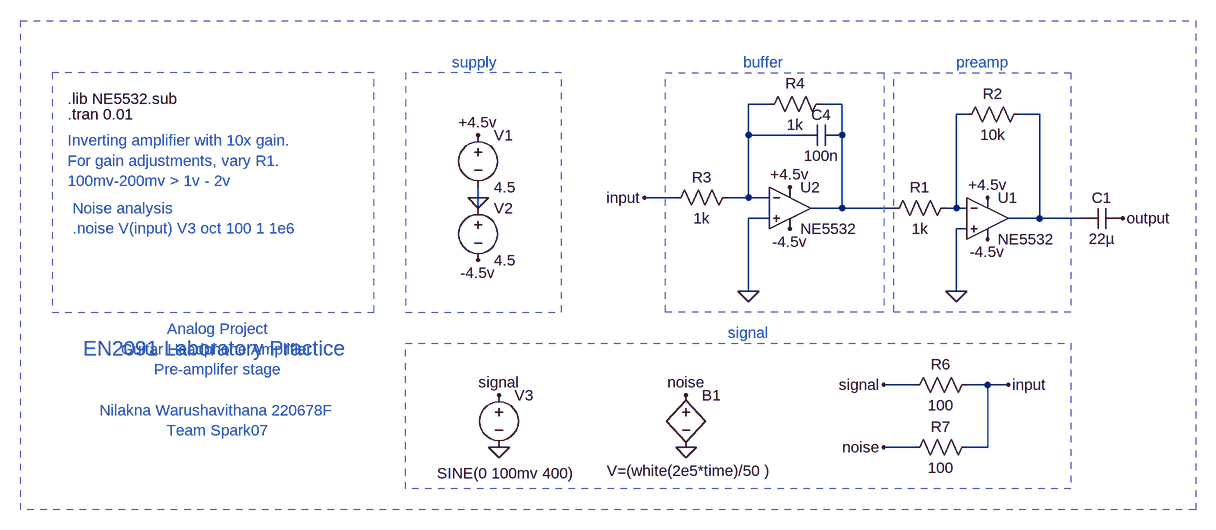
[diagram p0: schematic preamp_9vdual_opamp_NE5532.asc]
preamp_9vdual_opamp_NE5532.asc, the LTspice schematic file:
Version 4
SHEET 1 1812 680
WIRE 272 16 240 16
WIRE 384 16 352 16
WIRE 576 32 560 32
WIRE 688 32 656 32
WIRE 240 64 240 16
WIRE 320 64 240 64
WIRE 384 64 384 16
WIRE -176 160 -176 144
WIRE 128 160 80 160
WIRE 240 160 240 64
WIRE 240 160 208 160
WIRE 272 160 240 160
WIRE -176 176 -176 160
WIRE 384 176 384 64
WIRE 384 176 336 176
WIRE 464 176 384 176
WIRE 560 176 560 32
WIRE 560 176 544 176
WIRE 576 176 560 176
WIRE 272 192 240 192
WIRE 688 192 688 32
WIRE 688 192 640 192
WIRE 752 192 688 192
WIRE 576 208 560 208
WIRE 240 304 240 192
WIRE 560 304 560 208
WIRE 496 448 448 448
WIRE 608 448 576 448
WIRE 640 448 608 448
WIRE 496 544 448 544
WIRE 608 544 608 448
WIRE 608 544 576 544
FLAG -176 160 0
FLAG -176 64 +4.5v
FLAG 608 160 +4.5v
FLAG 608 224 -4.5v
FLAG -176 256 -4.5v
FLAG -144 544 0
FLAG -144 464 signal
FLAG 80 160 input
FLAG 560 304 0
FLAG 240 304 0
FLAG 304 144 +4.5v
FLAG 304 208 -4.5v
FLAG 816 192 output
FLAG 144 544 0
FLAG 144 464 noise
FLAG 448 448 signal
FLAG 448 544 noise
FLAG 640 448 input
SYMBOL OpAmps\\opamp2 608 128 R0
SYMATTR InstName U1
SYMATTR Value NE5532
SYMBOL voltage -176 48 R0
WINDOW 123 0 0 Left 0
WINDOW 39 0 0 Left 0
SYMATTR InstName V1
SYMATTR Value 4.5
SYMBOL voltage -176 160 R0
WINDOW 123 0 0 Left 0
WINDOW 39 0 0 Left 0
SYMATTR InstName V2
SYMATTR Value 4.5
SYMBOL voltage -144 448 R0
WINDOW 3 -95 136 Left 2
WINDOW 123 0 0 Left 0
WINDOW 39 0 0 Left 0
SYMATTR InstName V3
SYMATTR Value SINE(0 100mv 400)
SYMBOL res 560 160 R90
WINDOW 0 0 56 VBottom 2
WINDOW 3 32 56 VTop 2
SYMATTR InstName R1
SYMATTR Value 1k
SYMBOL res 672 16 R90
WINDOW 0 0 56 VBottom 2
WINDOW 3 32 56 VTop 2
SYMATTR InstName R2
SYMATTR Value 10k
SYMBOL cap 816 176 R90
WINDOW 0 0 32 VBottom 2
WINDOW 3 32 32 VTop 2
SYMATTR InstName C1
SYMATTR Value 22µ
SYMBOL OpAmps\\opamp2 304 112 R0
SYMATTR InstName U2
SYMATTR Value NE5532
SYMBOL res 224 144 R90
WINDOW 0 0 56 VBottom 2
WINDOW 3 32 56 VTop 2
SYMATTR InstName R3
SYMATTR Value 1k
SYMBOL res 368 0 R90
WINDOW 0 0 56 VBottom 2
WINDOW 3 32 56 VTop 2
SYMATTR InstName R4
SYMATTR Value 1k
SYMBOL bv 144 448 R0
WINDOW 3 -122 132 Left 2
SYMATTR InstName B1
SYMATTR Value V=(white(2e5*time)/50 )
SYMBOL res 592 432 R90
WINDOW 0 0 56 VBottom 2
WINDOW 3 32 56 VTop 2
SYMATTR InstName R6
SYMATTR Value 100
SYMBOL res 592 528 R90
WINDOW 0 0 56 VBottom 2
WINDOW 3 32 56 VTop 2
SYMATTR InstName R7
SYMATTR Value 100
SYMBOL cap 384 48 R90
WINDOW 0 0 32 VBottom 2
WINDOW 3 32 32 VTop 2
SYMATTR InstName C4
SYMATTR Value 100n
TEXT -808 8 Left 2 !.lib NE5532.sub
TEXT -808 32 Left 2 !.tran 0.01
TEXT -808 72 Left 2 ;Inverting amplifier with 10x gain.\nFor gain adjustments, vary R1.\n100mv-200mv > 1v - 2v
TEXT 232 -48 Left 2 ;buffer
TEXT 560 -48 Left 2 ;preamp
TEXT -216 -48 Left 2 ;supply
TEXT 208 368 Left 2 ;signal
TEXT -784 392 Left 3 ;EN2091 Laboratory Practice
TEXT -576 440 Center 2 ;Analog Project\nGuitar Headphone Amplifier\nPre-amplifer stage\n \nNilakna Warushavithana 220678F\nTeam Spark07
TEXT -800 176 Left 2 ;Noise analysis\n.noise V(input) V3 oct 100 1 1e6
RECTANGLE Normal 448 336 112 -32 2
RECTANGLE Normal 736 336 464 -32 2
RECTANGLE Normal -48 -32 -288 336 2
RECTANGLE Normal 736 608 -288 384 2
RECTANGLE Normal 928 640 -880 -112 2
RECTANGLE Normal -832 336 -336 -32 2

The netlist it stands for:
* preamp_9vdual_opamp_NE5532.asc
XU1 0 N003 +4.5v -4.5v N004 NE5532  ; pins In+ In- V+ V- OUT
V1 +4.5v 0 4.5
V2 0 -4.5v 4.5
V3 signal 0 SINE(0 100mv 400)
R1 N003 N002 1k
R2 N004 N003 10k
C1 output N004 22µ
XU2 0 N001 +4.5v -4.5v N002 NE5532  ; pins In+ In- V+ V- OUT
R3 N001 input 1k
R4 N002 N001 1k
B1 noise 0 V=(white(2e5*time)/50 )
R6 input signal 100
R7 input noise 100
C4 N002 N001 100n
.lib NE5532.sub
.tran 0.01
* Inverting amplifier with 10x gain.
* For gain adjustments, vary R1.
* 100mv-200mv > 1v - 2v
* buffer
* preamp
* supply
* signal
* EN2091 Laboratory Practice
* Analog Project
* Guitar Headphone Amplifier
* Pre-amplifer stage
* Nilakna Warushavithana 220678F
* Team Spark07
* Noise analysis
* .noise V(input) V3 oct 100 1 1e6
.backanno
.end